# EAGLE design Microscope_LED_Ring_Light (EAGLE 7.7.0)
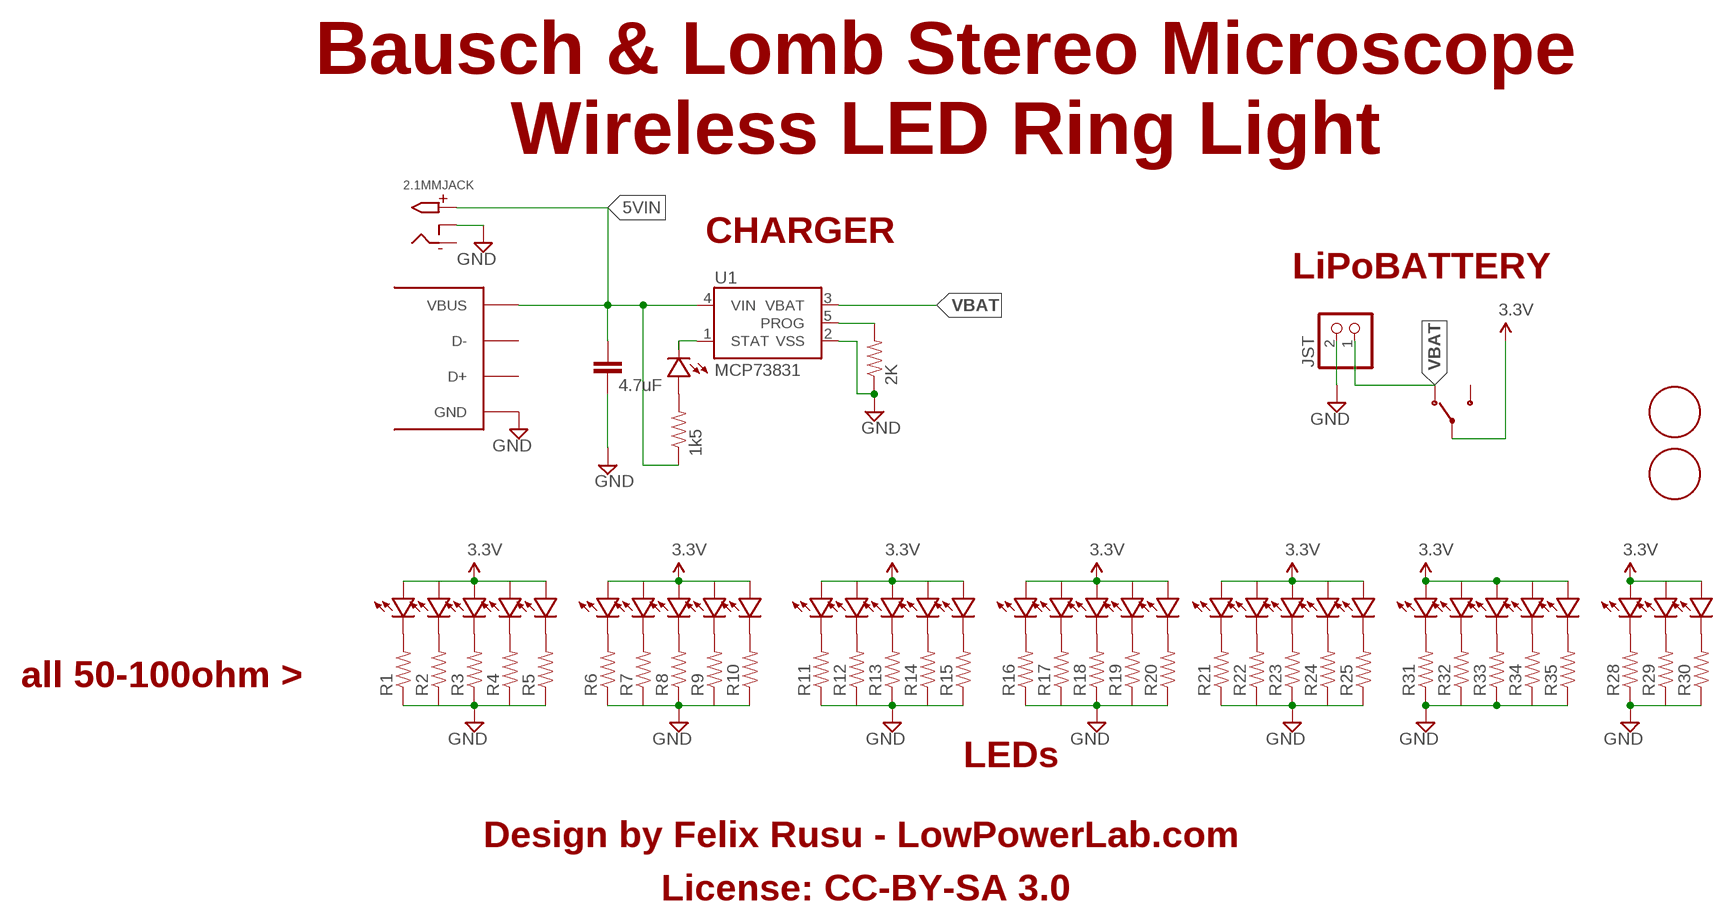
[diagram p0: schematic, sheet 1]

## Parts
2.1MMJACK  2.1MMJACKSLOTS  [2.1MM_JACK_SLOTS]
C1  4.7uF  CAP0603-CAP  [0603-CAP]
FIDUCIAL_BOTTOMRIGHT  FIDUCIAL1.5MM  [FIDUCIAL_1.5MM]
FIDUCIAL_TOPLEFT  FIDUCIAL1.5MM  [FIDUCIAL_1.5MM]
JST  JST_2PIN-SMT-RA  [JST-PH-2-SMT-RA]
R1  RESISTOR0805  [0805]
R2  RESISTOR0805  [0805]
R3  RESISTOR0805  [0805]
R4  RESISTOR0805  [0805]
R5  RESISTOR0805  [0805]
R6  RESISTOR0805  [0805]
R7  RESISTOR0805  [0805]
R8  RESISTOR0805  [0805]
R9  RESISTOR0805  [0805]
R10  RESISTOR0805  [0805]
R11  RESISTOR0805  [0805]
R12  RESISTOR0805  [0805]
R13  RESISTOR0805  [0805]
R14  RESISTOR0805  [0805]
R15  RESISTOR0805  [0805]
R16  RESISTOR0805  [0805]
R17  RESISTOR0805  [0805]
R18  RESISTOR0805  [0805]
R19  RESISTOR0805  [0805]
R20  RESISTOR0805  [0805]
R21  RESISTOR0805  [0805]
R22  RESISTOR0805  [0805]
R23  RESISTOR0805  [0805]
R24  RESISTOR0805  [0805]
R25  RESISTOR0805  [0805]
R26  1k5  RESISTOR0603-RES  [0603-RES]
R27  2K  RESISTOR0603-RES  [0603-RES]
R28  RESISTOR0805  [0805]
R29  RESISTOR0805  [0805]
R30  RESISTOR0805  [0805]
R31  RESISTOR0805  [0805]
R32  RESISTOR0805  [0805]
R33  RESISTOR0805  [0805]
R34  RESISTOR0805  [0805]
R35  RESISTOR0805  [0805]
U1  MCP73831  [SOT23-5]
U$1  LED  [LED_2.8X3.3MM]
U$2  LED  [LED_2.8X3.3MM]
U$3  LED  [LED_2.8X3.3MM]
U$4  LED  [LED_2.8X3.3MM]
U$5  LED  [LED_2.8X3.3MM]
U$6  LED  [LED_2.8X3.3MM]
U$7  LED  [LED_2.8X3.3MM]
U$8  LED  [LED_2.8X3.3MM]
U$9  LED  [LED_2.8X3.3MM]
U$10  LED  [LED_2.8X3.3MM]
U$11  LED  [LED_2.8X3.3MM]
U$12  LED  [LED_2.8X3.3MM]
U$13  LED  [LED_2.8X3.3MM]
U$14  LED  [LED_2.8X3.3MM]
U$15  LED  [LED_2.8X3.3MM]
U$16  LED  [LED_2.8X3.3MM]
U$17  LED  [LED_2.8X3.3MM]
U$18  LED  [LED_2.8X3.3MM]
U$19  LED  [LED_2.8X3.3MM]
U$20  LED  [LED_2.8X3.3MM]
U$21  LED  [LED_2.8X3.3MM]
U$22  LED  [LED_2.8X3.3MM]
U$23  LED  [LED_2.8X3.3MM]
U$24  LED  [LED_2.8X3.3MM]
U$25  LED  [LED_2.8X3.3MM]
U$26  USB_4PIN2PINS_SLOTTED  [USB-B-MICRO_2PADS_SLOTS]
U$27  SWITCH_SPDT  [SWITCH-SPDT_CKN9560]
U$28  LED0603  [0603-LED]
U$29  LED  [LED_2.8X3.3MM]
U$30  LED  [LED_2.8X3.3MM]
U$31  LED  [LED_2.8X3.3MM]
U$32  LED  [LED_2.8X3.3MM]
U$33  LED  [LED_2.8X3.3MM]
U$34  LED  [LED_2.8X3.3MM]
U$35  LED  [LED_2.8X3.3MM]
U$36  LED  [LED_2.8X3.3MM]

## Nets
3.3V: U$1.PLUS U$2.PLUS U$3.PLUS U$4.PLUS U$5.PLUS U$6.PLUS U$7.PLUS U$8.PLUS U$9.PLUS U$10.PLUS U$11.PLUS U$12.PLUS U$13.PLUS U$14.PLUS U$15.PLUS U$16.PLUS U$17.PLUS U$18.PLUS U$19.PLUS U$20.PLUS U$21.PLUS U$22.PLUS U$23.PLUS U$24.PLUS U$25.PLUS U$27.2 U$29.PLUS U$30.PLUS U$31.PLUS U$32.PLUS U$33.PLUS U$34.PLUS U$35.PLUS U$36.PLUS
5VIN: 2.1MMJACK.TIP C1.1 R26.1 U1.4(VIN) U$26.VBUS
GND: 2.1MMJACK.SIDE(RING_SW) C1.2 JST.2 R1.1 R2.1 R3.1 R4.1 R5.1 R6.1 R7.1 R8.1 R9.1 R10.1 R11.1 R12.1 R13.1 R14.1 R15.1 R16.1 R17.1 R18.1 R19.1 R20.1 R21.1 R22.1 R23.1 R24.1 R25.1 R27.1 R28.1 R29.1 R30.1 R31.1 R32.1 R33.1 R34.1 R35.1 U1.2(VSS) U$26.GND
N$1: R1.2 U$3.MINUS
N$2: R2.2 U$4.MINUS
N$3: R3.2 U$5.MINUS
N$4: R4.2 U$6.MINUS
N$5: R5.2 U$7.MINUS
N$6: R6.2 U$1.MINUS
N$7: R7.2 U$2.MINUS
N$8: R8.2 U$8.MINUS
N$9: R9.2 U$9.MINUS
N$10: R10.2 U$10.MINUS
N$11: R11.2 U$11.MINUS
N$12: R12.2 U$12.MINUS
N$13: R13.2 U$13.MINUS
N$14: R14.2 U$14.MINUS
N$15: R15.2 U$15.MINUS
N$16: R16.2 U$16.MINUS
N$17: R17.2 U$17.MINUS
N$18: R18.2 U$18.MINUS
N$19: R19.2 U$19.MINUS
N$20: R20.2 U$20.MINUS
N$21: R21.2 U$21.MINUS
N$22: R22.2 U$22.MINUS
N$23: R23.2 U$23.MINUS
N$24: R24.2 U$24.MINUS
N$25: R25.2 U$25.MINUS
N$26: R28.2 U$29.MINUS
N$27: R26.2 U$28.PLUS
N$28: R27.2 U1.5(PROG)
N$29: R29.2 U$30.MINUS
N$30: R30.2 U$31.MINUS
N$31: R31.2 U$32.MINUS
N$32: R32.2 U$33.MINUS
N$33: R33.2 U$34.MINUS
N$34: R34.2 U$35.MINUS
N$35: R35.2 U$36.MINUS
STAT: U1.1(STAT) U$28.MINUS
VBAT: JST.1 U1.3(VBAT) U$27.1
Unconnected: 2.1MMJACK.RING FIDUCIAL_BOTTOMRIGHT.P$1(FIDUCIAL) FIDUCIAL_TOPLEFT.P$1(FIDUCIAL) U$26.MT1(D+) U$26.MT2(D-) U$27.3

## Notes on the sheet
- Bausch & Lomb Stereo Microscope
  Wireless LED Ring Light
- CHARGER
- LiPoBATTERY
- all 50-100ohm >
- LEDs
- Design by Felix Rusu - LowPowerLab.com
- License: CC-BY-SA 3.0

## Library data of the parts
2.1MMJACK = LowPowerLab:2.1MMJACK: 2.1mm x 5.5mm THM DC jack with internal switch. Digikey part #PJ-102A, 4UCON part #05537 2.1mm x 5.5mm SMT DC jack with internal switch. Digikey part #PJ-002A-SMT, 4UCON part #03267 By microbuilder.eu & adafruit.com
C1 = LowPowerLab:CAP: Capacitor Standard 0603 ceramic capacitor, and 0.1" leaded capacitor.
FIDUCIAL_BOTTOMRIGHT FIDUCIAL_TOPLEFT = LowPowerLab:FIDUCIAL
JST = LowPowerLab:JST_2PIN: JST 2-Pin Connectors of various flavors SMT-RA (S2B-PH-SM4) 4UConnector #17311 SMT (B2B-PH-SM4) THM-RA (S2B-PH) THM (B2B-PH)
R1-R35 = LowPowerLab:RESISTOR: Resistor Basic schematic elements and footprints for 0603, 1206, and PTH resistors.
U1 = SparkFun:MCP73831: Microchip's MCP73831 Miniature single cell, fully integrated Li-Ion, Li-polymer charge management controller http://ww1.microchip.com/downloads/en/DeviceDoc/21984a.pdf
U$1-U$25 U$28-U$36 = LowPowerLab:LED
U$26 = LowPowerLab:USB_4PIN
U$27 = LowPowerLab:SWITCH_SPDT

## Net classes
1 power: width 0.381 mm, clearance 0.254 mm

## Board
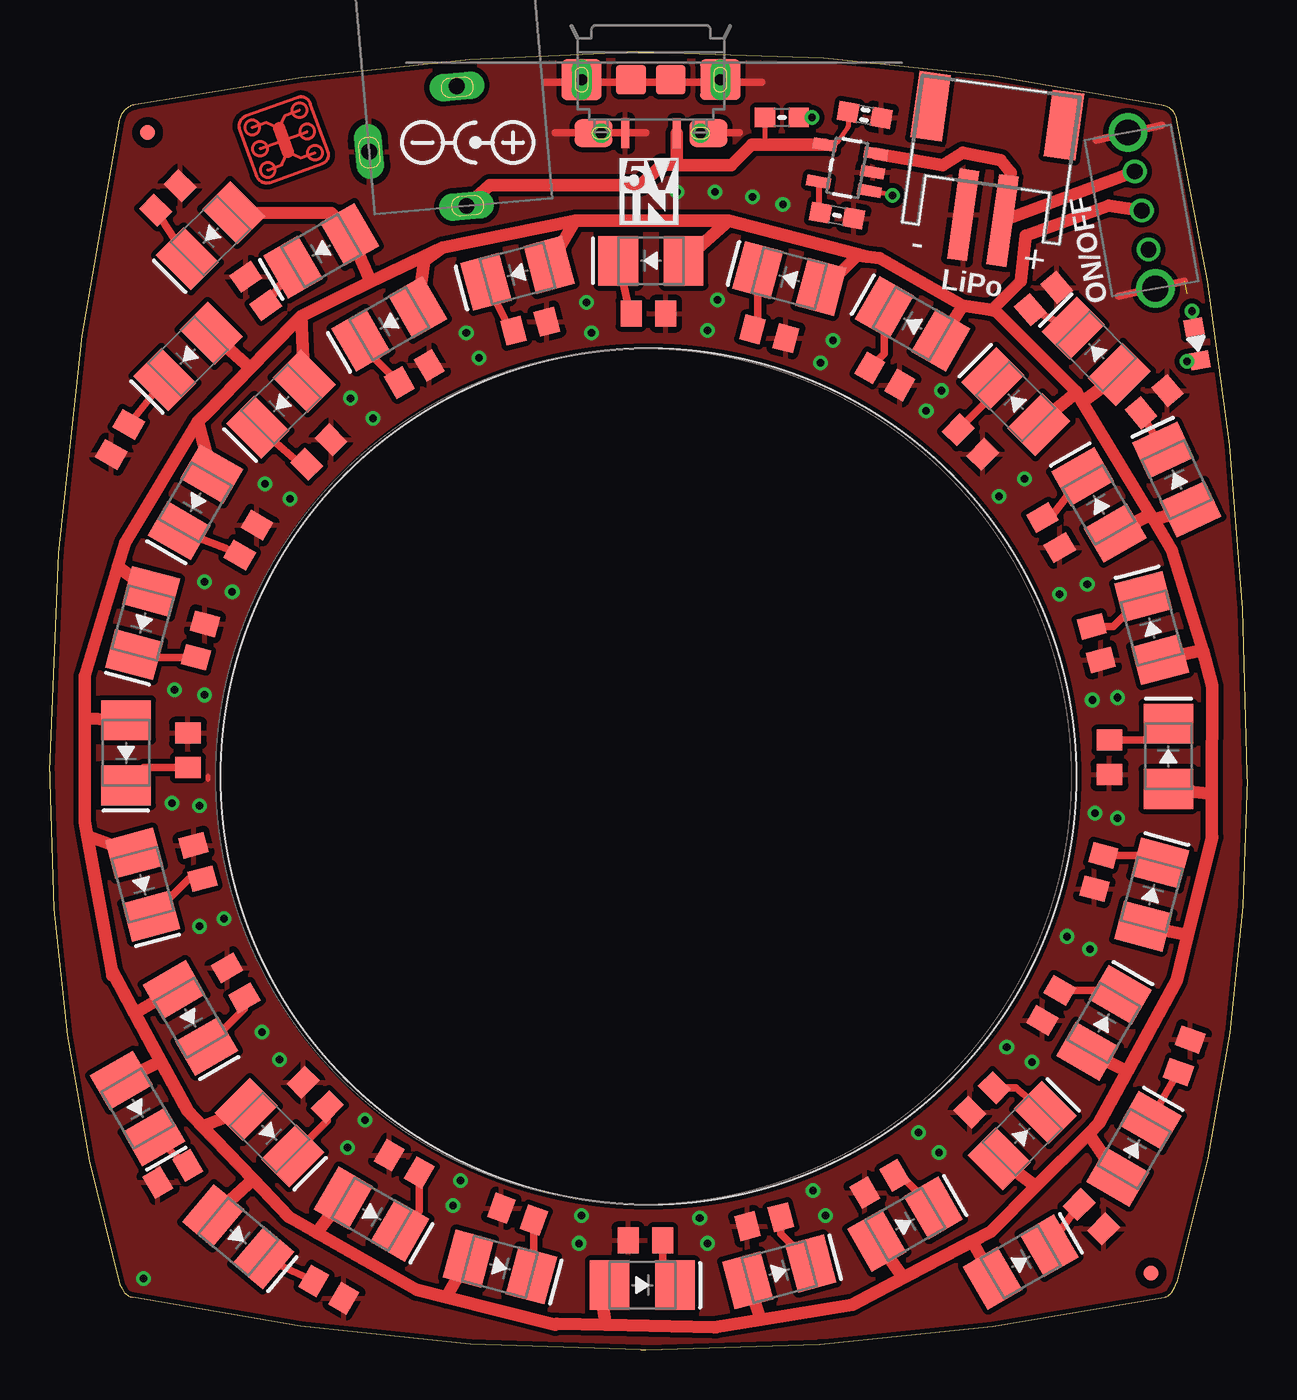
[diagram p1: board, top side]
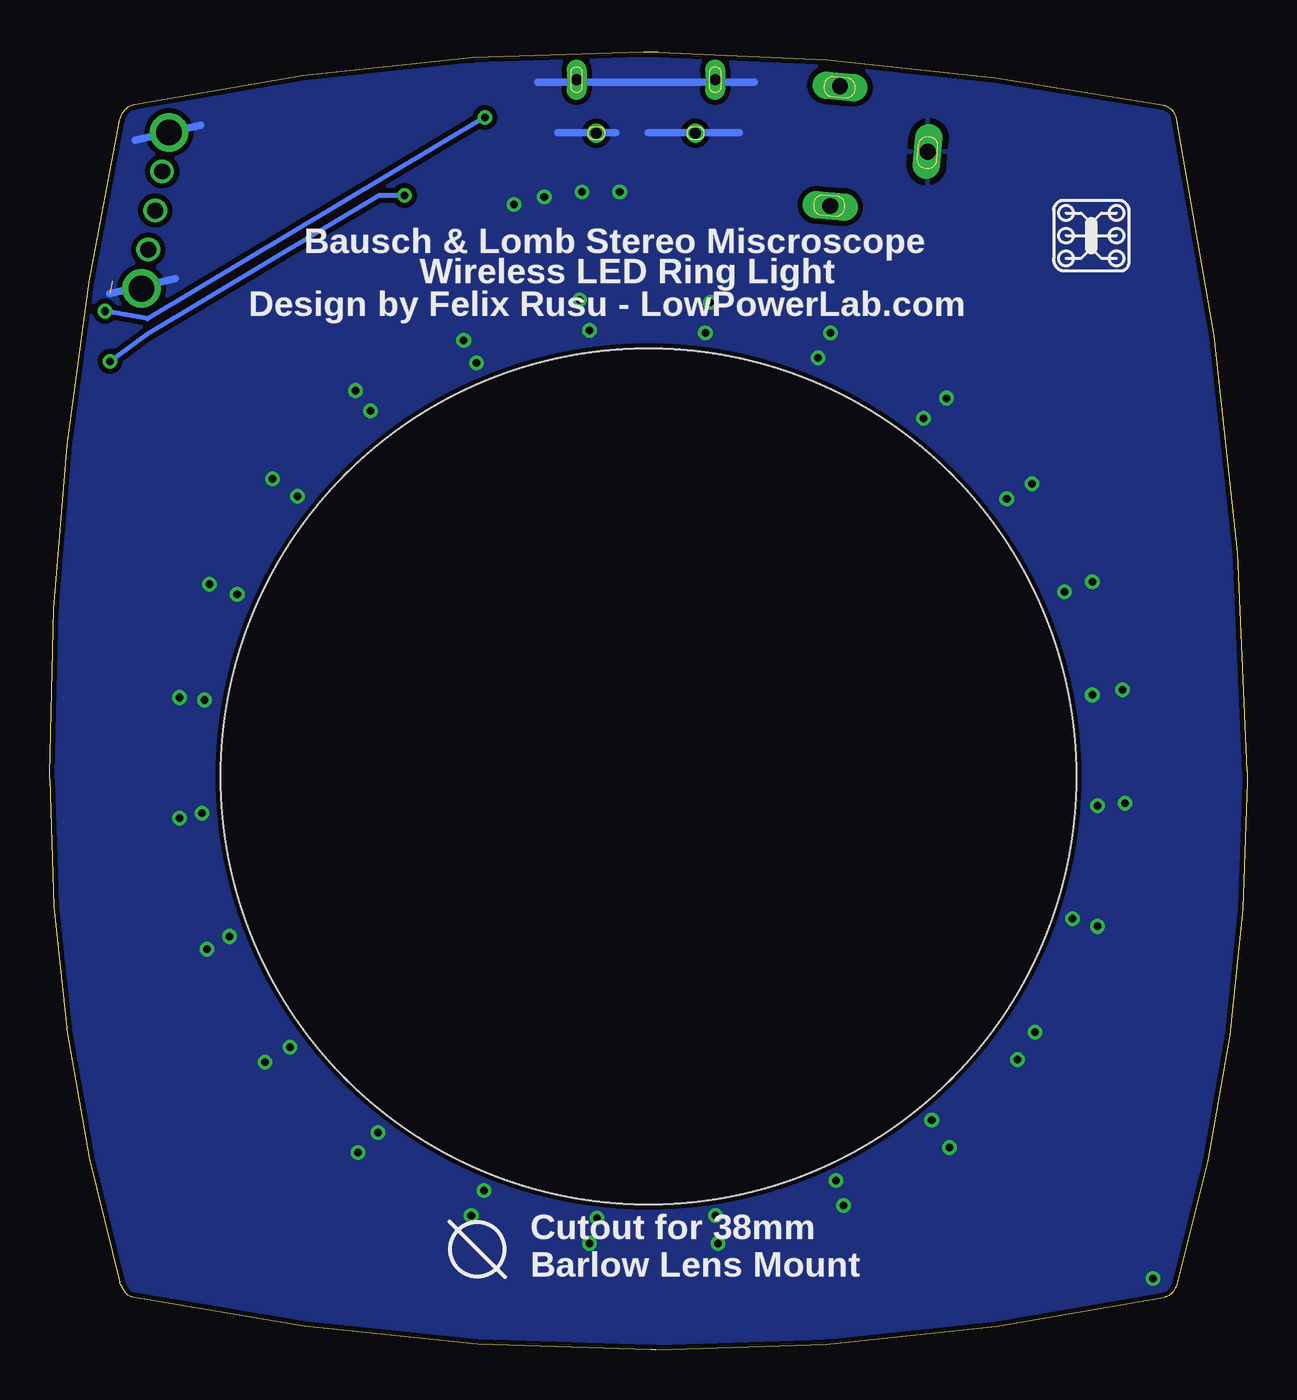
[diagram p2: board, bottom side, seen from below]

Size 60.45 x 65.53 mm. Coordinates in mm from the lower left corner, seen from the top.
Outline: 29.72,65.53 arc10 4.32,62.87 arc38 3.81,62.61 arc37 3.56,62.1 arc11 0,29.21 0,28.7 arc16 3.56,3.3 arc11 3.68,3.05 arc58 4.19,2.67 arc12 29.84,0 30.1,0 arc12 56.26,2.67 arc44 56.64,2.92 arc15 56.9,3.43 arc16 60.45,28.83 60.45,29.08 arc12 56.9,62.1 arc38 56.64,62.61 arc44 56.13,62.87 arc12 30.48,65.53 29.72,65.53
Copper layers (1*16): Top 0.0356mm / dielectric 1.5011mm / Bottom 0.0356mm
Design rules "RaspiONOFF *": minimum track width 6mil, minimum drill 13mil, track to track 10mil, track to pad 10mil, pad to pad 6mil, via to via 6mil, smd to smd 6mil, copper to edge 10mil, drill to drill 6mil, minimum pad ring 7mil, minimum via ring 7mil, stop-mask expansion 4mil, vias tented up to drill 20mil, thermal gap 12mil
Holes 43.18 mm at 30.23,28.96

### Footprints (pad centres in the part's own frame; a part is rotated, then mirrored left to right if it is on the bottom)
2.1MM_JACK_SLOTS = drill 0.8 pad 1.4 long: RING -0.01,0.05; SIDE -4.71,-2.85; TIP -0.05,-6.01
0603-CAP = smd 1.016 x 0.965: 1 -0.85,0; 2 0.85,0
FIDUCIAL_1.5MM = smd 0.762 x 0.762: P$1 0,0
JST-PH-2-SMT-RA = smd 1 x 4.6: 1 1,-3.7; 2 -1,-3.7 | smd 1.6 x 3.4: NC1 -3.4,1.5; NC2 3.4,1.5
0805 = smd 1.054 x 1.3: 1 -0.873,0; 2 0.873,0
0603-RES = smd 1.016 x 0.965: 1 -0.85,0; 2 0.85,0
SOT23-5 = smd 0.55 x 1.2: 1 -0.95,-1.3; 2 0,-1.3; 3 0.95,-1.3; 4 0.95,1.3; 5 -0.95,1.3
LED_2.8X3.3MM = smd 2 x 2.5: MINUS 1.65,0; PLUS -1.65,0
USB-B-MICRO_2PADS_SLOTS = smd 0.4 x 1.5: GND 1.3,2.701; VBUS -1.3,2.701 | smd 2.05 x 2.05: MT1 -3.5,0 | smd 2.032 x 2.05: MT2 3.5,0 | smd 1.9 x 1.4: MT3 -2.9,2.7; MT4 2.9,2.7 | drill 0.55 pad 1.016 long: P$1 -3.5,0; P$3 3.5,0 | smd 1.5 x 1.5: P$4 1,0; P$7 -1,0 | drill 0.55 pad 0.95: P$5 -2.5,2.7; P$6 2.5,2.7
SWITCH-SPDT_CKN9560 = drill 0.8: 1 0,2; 2 0,0; 3 0,-2 | drill 1.3 pad 1.6: 4 0,-4; 5 0,4
0603-LED = smd 0.864 x 0.965: MINUS -0.85,0; PLUS 0.85,0

### Placement (x,y rotation side)
2.1MMJACK  20.57,63.75 5 top
C1  41.15,62.36 350 top
FIDUCIAL_BOTTOMRIGHT  55.6,3.89 0 top
FIDUCIAL_TOPLEFT  4.95,61.47 0 top
JST  47.62,60.83 352 top
R1  30.07,5.54 0 top
R2  6.99,30.28 270 top
R3  53.49,29.92 90 top
R4  13.41,12.9 315 top
R5  47.07,12.62 45 top
R6  13.59,45.34 225 top
R7  46.48,45.85 135 top
R8  24.26,51.69 195 top
R9  30.23,52.32 180 top
R10  18.41,49.28 210 top
R11  10.03,40.89 240 top
R12  7.62,35.81 255 top
R13  7.49,24.64 285 top
R14  9.4,18.54 300 top
R15  17.91,9.4 330 top
R16  23.62,6.86 340 top
R17  36.07,6.48 15 top
R18  50.55,17.4 60 top
R19  52.96,24.13 75 top
R20  41.91,8.38 30 top
R21  50.55,41.27 120 top
R22  52.83,35.69 105 top
R23  42.16,49.15 150 top
R24  36.32,51.31 165 top
R25  3.56,45.97 60 top
R26  36.96,62.23 0 top
R27  39.75,57.28 170 top
R28  5.97,58.17 225 top
R29  10.41,53.47 305 top
R30  6.22,8.89 30 top
R31  14.1,3.05 150 top
R32  52.58,6.73 135 top
R33  57.28,14.86 250 top
R34  50.16,53.09 220 top
R35  55.75,47.88 220 top
U1  40.26,59.69 80 top
U$1  11.68,47.75 225 top
U$2  48.77,47.88 135 top
U$3  29.92,3.28 0 top
U$4  3.86,30.15 270 top
U$5  56.46,29.97 90 top
U$6  11.1,10.97 315 top
U$7  49.1,10.82 45 top
U$8  23.62,54.36 195 top
U$9  30.35,54.99 180 top
U$10  17.14,51.82 210 top
U$11  7.37,42.8 240 top
U$12  4.7,36.7 255 top
U$13  4.7,23.5 285 top
U$14  7.11,16.76 300 top
U$15  16.26,6.86 330 top
U$16  22.73,4.19 345 top
U$17  36.83,3.94 15 top
U$18  53.21,16.51 60 top
U$19  55.63,22.99 75 top
U$20  43.18,6.35 30 top
U$21  52.96,42.67 120 top
U$22  55.63,36.45 105 top
U$23  43.56,51.82 150 top
U$24  37.34,54.1 165 top
U$25  6.99,50.16 225 top
U$26  30.35,64.14 180 top
U$27  55.12,57.53 10 top
U$28  57.91,50.8 100 top
U$29  8.13,56.26 225 top
U$30  13.72,55.5 210 top
U$31  4.45,12.19 300 top
U$32  9.53,5.71 320 top
U$33  49.02,4.45 30 top
U$34  54.74,10.16 60 top
U$35  52.83,50.42 135 top
U$36  56.9,43.94 115 top
U$37  [LOGO_LOWPOWERLAB_COPPER]  11.81,61.09 20 top
U$38  [LOGO_LOWPOWERLAB_STOP]  11.81,61.09 20 top
U$39  [LOGO_5VIN]  28.32,57.02 0 top
U$40  [LOGO_LOWPOWERLAB]  7.87,56.26 0 bottom

### Tracks (layer width: path | path; a pad name or v marks a point on that pad's centre or on a via)
3.3V
  Top 0.635: U$2.PLUS 50.42,47.2 51.85,48.36 47.62,52.58 | U$24.PLUS 39.2,53.67 40.77,55.24 41.24,55.19 | 41.24,55.19 41.91,55.12 46.09,52.72 | U$9.PLUS 34.29,57.02 | 34.29,57.02 41.24,55.19 | U$8.PLUS 26.54,57.02 | 26.54,57.02 34.29,57.02 | U$10.PLUS 18.92,54.99 19.83,55.66 | 19.83,55.66 26.54,57.02 | U$1.PLUS 12.7,52.2 | 12.7,52.2 14.38,53.02 14.58,53.13 16.21,53.93 | 16.21,53.93 19.83,55.66 | U$11.PLUS 7.49,46.86 | 7.49,46.86 8,47.38 10.13,49.57 | 10.13,49.57 11.07,50.53 12.7,52.2 | 7.49,46.86 3.81,40.77 3.44,39.56 | 3.44,39.56 1.78,34.04 1.78,31.88 | 1.78,31.88 1.78,26.67 1.91,25.94 | 3.17,18.92 3.13,19.17 | 3.13,19.17 1.91,25.94 | 5.62,14.58 6.99,12.06 7.72,11.29 | 5.62,14.58 4.31,16.99 | 4.31,16.99 3.13,19.17 | 10.28,8.61 12.06,6.73 13.48,5.93 | 10.28,8.61 7.72,11.29 | 13.48,5.93 18.54,3.05 20.03,2.67 | U$3.PLUS 27.81,2.92 28.06,1.27 | 20.03,2.67 25.53,1.27 25.6,1.32 28.06,1.27 | 33.66,1.14 33.54,1.15 | 33.54,1.15 28.06,1.27 | 35.9,1.53 40.51,2.29 43.09,3.64 | 35.9,1.53 33.54,1.15 | 46.58,5.49 47.5,5.97 49.78,8.26 | 46.58,5.49 43.09,3.64 | 52.45,10.92 52.96,11.43 54.39,14.06 | 52.45,10.92 49.78,8.26 | 54.39,14.06 56.9,18.67 57.45,20.95 | 57.45,20.95 58.67,25.91 58.66,25.85 58.66,28.07 | 58.66,28.07 58.67,33.53 58.21,35.35 | 58.21,35.35 56.64,40.39 55.72,41.91 | 46.09,52.72 U$23.PLUS | 51.82,48.39 52.13,47.86 | 52.13,47.86 55.56,42.18 | 55.56,42.18 55.72,41.91 | 46.09,52.72 47.3,52.56 47.69,52.48 47.62,52.58 | U$31.PLUS 5.62,14.58 | U$32.PLUS 10.28,8.61 | U$33.PLUS 46.58,5.49 | U$34.PLUS 52.45,10.92 | 16.21,53.93 U$30.PLUS 14.22,57.4 U$29.PLUS | U$25.PLUS 10.13,49.57 | U$27.2 53.47,57.78 49.28,56.26 49.02,53.98 47.62,52.58 | U$22.PLUS 58.21,35.35
  Top 0.635: U$5.PLUS 58.66,28.07 | U$35.PLUS 52.13,47.86 | U$21.PLUS 55.56,42.18 | U$36.PLUS 55.72,41.91 | U$12.PLUS 3.44,39.56 | U$4.PLUS 1.78,31.88 | U$13.PLUS 1.91,25.94 | U$6.PLUS 7.72,11.29 | U$14.PLUS 4.31,16.99 | U$15.PLUS 13.48,5.93 | U$16.PLUS 20.03,2.67 | U$17.PLUS 35.9,1.53 | U$20.PLUS 43.09,3.64 | U$7.PLUS 49.78,8.26 | U$18.PLUS 54.39,14.06 | U$19.PLUS 57.45,20.95
5VIN
  Top 0.254: R26.1 36.11,61.07 36.32,60.85 | C1.1 40.31,61.77 39.75,60.96 39.25,60.96 U1.4
  Top 0.635: U$26.VBUS 31.65,59.85 | 21.45,58.04 2.1MMJACK.TIP 22.22,58.8 29.84,58.8 30.89,59.85 31.65,59.85 | U1.4 36.32,60.85 35.45,60.85 34.42,59.82 31.68,59.82 31.65,59.85
GND  (via drill 0.38)  (1 unrouted)
  Top 0.254: 8,28.83 arc0 8,28.96
  Top 0.381: 57.28,53.98 53.98,53.21 | 52.83,61.09 56.13,61.85 | 25.02,64.01 35.94,64.01 | 25.53,61.47 30.1,61.47 | 32.64,61.47 34.8,61.47
  Bottom 0.381: 54.1,54.1 57.4,53.34 | 52.83,61.85 56.13,61.09 | 35.81,64.01 24.89,64.01 | 30.23,61.47 25.65,61.47 | 34.8,61.47 31.88,61.47
  other vias: 4.75,3.61 11.61,14.66 10.72,16.05 8.81,21.77 7.57,21.39 7.57,27.48 6.17,27.61 7.82,33.07 6.3,33.32 7.82,38.79 9.22,38.28 10.87,43.74 12.14,42.98 15.19,48.06 16.33,47.04 21.67,50.09 21.03,51.36 15.93,11.61 15.04,10.21 20.75,8.56 20.37,7.29 26.85,6.78 26.72,5.38 32.82,6.65 33.2,5.38 38.53,8.05 39.17,6.78 43.87,10.97 44.88,9.96 49.58,14.53 48.31,15.29 51.36,20.88 52.5,20.24 52.76,27.1 53.9,26.85 53.9,32.94 52.63,32.82 52.37,38.66 50.98,38.15 49.2,43.99 47.93,43.1 45.01,48.44 44.25,47.42 39.55,50.98 38.91,49.83 31.67,58.47 33.2,51.49 33.71,53.01 27.1,52.88 27.36,51.36 33.58,58.47 35.48,58.22 37.01,57.84
  pour Bottom: 56.77,62.74 44.2,64.77 29.97,65.53 17.02,64.77 3.68,62.61 0.38,43.69 0,26.92 1.14,13.46 3.81,2.92 12.83,0.89 30.61,0 44.96,0.64 56.77,2.92 59.44,14.61 60.45,28.96 59.44,47.88
  pour Top: 3.68,62.74 15.49,64.64 30.48,65.53 42.55,65.02 56.77,62.61 59.56,47.12 60.45,26.92 59.69,15.37 56.64,2.92 44.45,0.64 29.84,0 13.59,0.89 3.68,2.92 1.14,13.46 0,28.96 0.89,47.88
N$1
  Top 0.381: R1.2 30.95,3.9 U$3.MINUS
N$2
  Top 0.381: R2.2 4.76,29.4 U$4.MINUS
N$3
  Top 0.381: R3.2 55.64,30.79 U$5.MINUS
N$4
  Top 0.381: R4.2 14.03,11.57 U$6.MINUS
N$5
  Top 0.381: R5.2 48.76,13.24 U$7.MINUS
N$6
  Top 0.381: R6.2 12.38,44.98 U$1.MINUS
N$7
  Top 0.381: U$2.MINUS 47.6,48.2 R7.2
N$8
  Top 0.381: R8.2 23.13,51.76 U$8.MINUS
N$9
  Top 0.381: U$9.MINUS 29.21,52.72 R9.2
N$10
  Top 0.381: U$10.MINUS 15.72,50.74 R10.2
N$11
  Top 0.381: U$11.MINUS 8.87,40.48 R11.2
N$12
  Top 0.381: R12.2 4.41,34.97 U$12.MINUS
N$13
  Top 0.381: R13.2 7.02,23.8 U$13.MINUS
N$14
  Top 0.381: R14.2 9.84,17.23 U$14.MINUS
N$15
  Top 0.381: R15.2 18.66,7.01 U$15.MINUS
N$16
  Top 0.381: R16.2 24.44,3.88 U$16.MINUS
N$17
  Top 0.381: R17.2 36.91,5.88 U$17.MINUS
N$18
  Top 0.381: R18.2 53.44,18.16 U$18.MINUS
N$19
  Top 0.381: R19.2 55.66,24.97 U$19.MINUS
N$20
  Top 0.381: R20.2 42.97,8.82 U$20.MINUS
N$21
  Top 0.381: R21.2 50.32,41.78 U$21.MINUS
N$22
  Top 0.381: R22.2 53.69,36.53 U$22.MINUS
N$23
  Top 0.381: U$23.MINUS 42.13,50.31 R23.2
N$24
  Top 0.381: U$24.MINUS 35.74,51.8 R24.2
N$25
  Top 0.381: U$25.MINUS R25.2
N$26
  Top 0.381: R28.2 U$29.MINUS
N$27  (via drill 0.38)
  Top 0.254: R26.2 v38.48,62.23 | v57.66,52.45 57.75,52.32 U$28.PLUS
  Bottom 0.254: v38.48,62.23 55.5,52.07 v57.66,52.45
N$28
  Top 0.305: U1.5 38.81,57.52 R27.2
N$29
  Top 0.381: R29.2 U$30.MINUS
N$30
  Top 0.381: U$31.MINUS R30.2
N$31
  Top 0.381: U$32.MINUS R31.2
N$32
  Top 0.381: U$33.MINUS R32.2
N$33
  Top 0.381: U$34.MINUS R33.2
N$34
  Top 0.381: U$35.MINUS R34.2
N$35
  Top 0.381: U$36.MINUS R35.2
STAT  (via drill 0.38)
  Top 0.254: U$28.MINUS v57.4,49.91 | v42.55,58.29 U1.1
  Bottom 0.254: v57.4,49.91 55.5,51.31 43.81,58.29 v42.55,58.29
VBAT
  Top 0.635: U1.3 45.09,59.82 46.1,60.45 48.01,60.07 48.51,59.44 JST.1 U$27.1

### Text on the board
tPlace: ON/OFF | LiPo
bPlace: Bausch & Lomb Stereo Miscroscope | Wireless LED Ring Light | Design by Felix Rusu - LowPowerLab.com | Cutout for 38mm / Barlow Lens Mount